# Altium project Underwater ROV PDB.PrjPcb
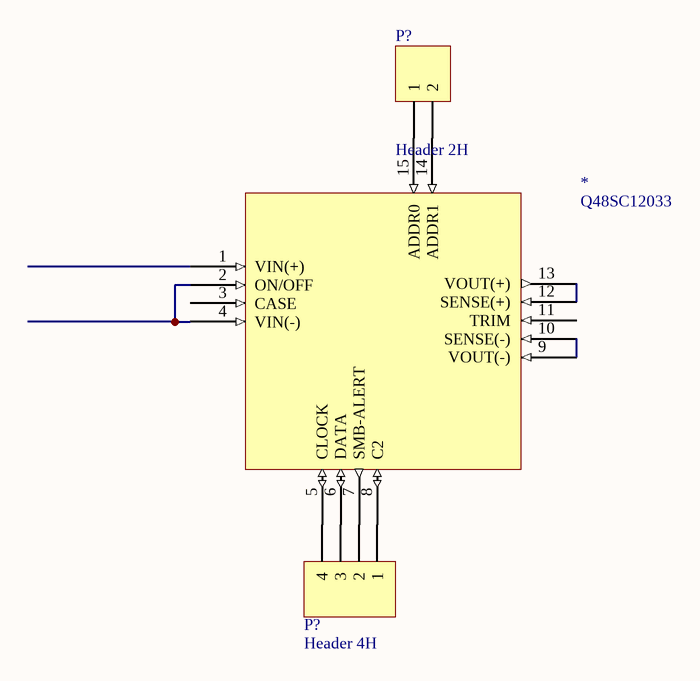
[diagram p0: Top_Level_Underwater_ROV_PDB.SchDoc]
2 sheets, 17 parts. Net scope: global (net labels, ports and power ports of the same name join across sheets).
Board file: 5V_Regulator.PcbDoc
Sheets:
  Top_Level_Underwater_ROV_PDB.SchDoc
  5V_Regulator.schdoc

## Sheet Top_Level_Underwater_ROV_PDB.SchDoc
size A

### Parts
(Parts that share a designator on the sheet are numbered #1, #2 ... from top to bottom, then left to right.)
*  Q48SC12033
P?#1  Header 2H  [HDR1X2H]
P?#2  Header 4H  [HDR1X4H]

### Nets
Net*_2: *.2(ON/OFF) *.4(VIN(-))
Net*_5: *.5(CLOCK) P?#2.4
Net*_6: *.6(DATA) P?#2.3
Net*_7: *.7(SMB-ALERT) P?#2.2
Net*_8: *.8(C2) P?#2.1
Net*_9: *.9(VOUT(-)) *.10(SENSE(-))
Net*_12: *.12(SENSE(+)) *.13(VOUT(+))
Net*_14: *.14(ADDR1) P?#1.2
Net*_15: *.15(ADDR0) P?#1.1

Not connected (* = marked no-connect by the designer): * 1(VIN(+)) 3(CASE) 11(TRIM)

### Library data of the parts
P?#1 = Header 2H: Header, 2-Pin, Right Angle; LatestRevisionDate: 17-Jul-2002; LatestRevisionNote: Re-released for DXP Platform.; Publisher: Altium Limited
P?#2 = Header 4H: Header, 4-Pin, Right Angle; LatestRevisionDate: 17-Jul-2002; LatestRevisionNote: Re-released for DXP Platform.; Publisher: Altium Limited

## Sheet 5V_Regulator.schdoc
size 394 x 144 mm; SheetNumber: 1; SheetTotal: 1
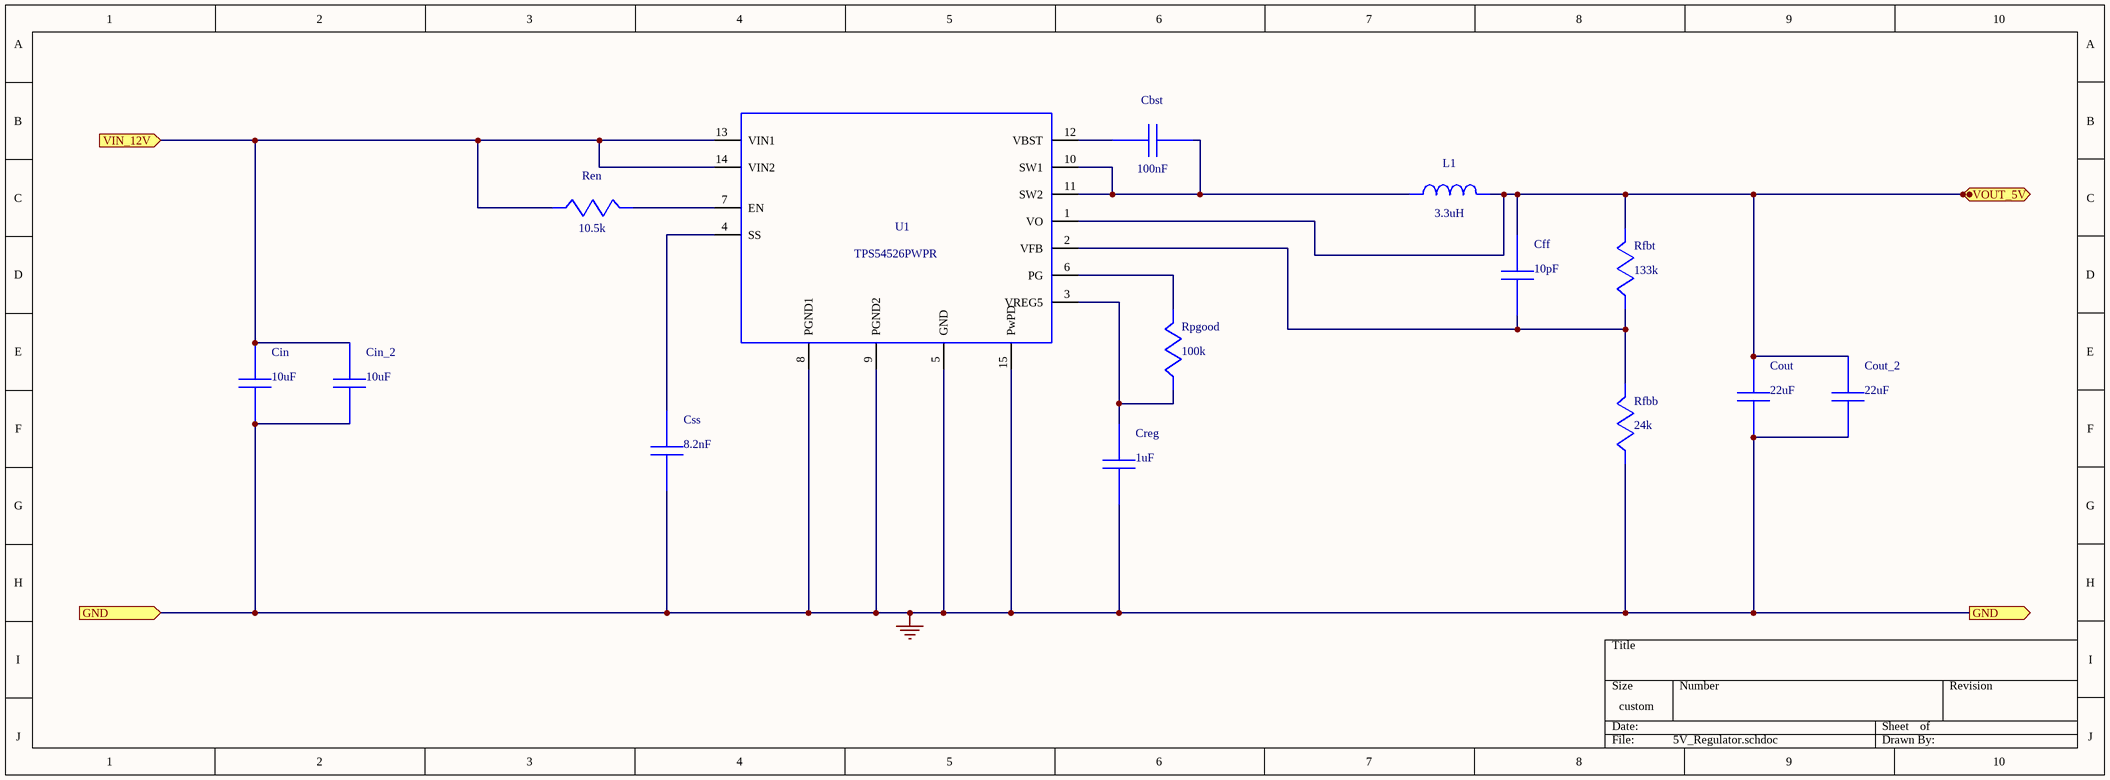
[diagram p1: 5V_Regulator.schdoc]

### Parts
Cbst  value 100nF  (hidden comment: GRM155R61A104KA01D)
Cff  value 10pF  (hidden comment: GCM0335C1E100JD03D)
Cin  value 10uF  (hidden comment: GRM21BR61C106KE15L)
Cin_2  value 10uF  (hidden comment: GRM21BR61C106KE15L)
Cout  value 22uF  (hidden comment: LMK212BJ226MG-T)
Cout_2  value 22uF  (hidden comment: LMK212BJ226MG-T)
Creg  value 1uF  (hidden comment: C0603C105Z8VACTU)
Css  value 8.2nF  (hidden comment: GRM033R61A822KA01D)
L1  value 3.3uH  (hidden comment: XAL5030-332MEB)
Ren  value 10.5k  (hidden comment: CRCW040210K5FKED)
Rfbb  value 24k  (hidden comment: RC0603FR-0724KL)
Rfbt  value 133k  (hidden comment: ERJ-6ENF1333V)
Rpgood  value 100k  (hidden comment: CRCW0402100KFKED)
U1  TPS54526PWPR

### Ports
GND (in), GND (out), VIN_12V (in), VOUT_5V (out)

### Nets
0: Cin.2 Cin_2.2 Cout.2 Cout_2.2 Creg.2 Css.2 Rfbb.2 U1.5(GND) U1.8(PGND1) U1.9(PGND2) U1.15(PwPD) ; port GND
NetCbst_1: Cbst.1 U1.12(VBST)
NetCbst_2: Cbst.2 L1.1 U1.10(SW1) U1.11(SW2)
NetCff_1: Cff.1 Cout.1 Cout_2.1 L1.2 Rfbt.1 U1.1(VO) ; port VOUT_5V
NetCff_2: Cff.2 Rfbb.1 Rfbt.2 U1.2(VFB)
NetCin_1: Cin.1 Cin_2.1 Ren.2 U1.13(VIN1) U1.14(VIN2) ; port VIN_12V
NetCreg_1: Creg.1 Rpgood.2 U1.3(VREG5)
NetCss_1: Css.1 U1.4(SS)
NetRen_1: Ren.1 U1.7(EN)
NetRpgood_1: Rpgood.1 U1.6(PG)

### Library data of the parts
Cbst = GRM155R61A104KA01D: GRM155R61A104KA0; Manufacturer Name: MuRata; PackageReference: GRM155R61A104KA01D; Manufacturer Part Number: GRM155R61A104KA01D
Cff = GCM0335C1E100JD03D: GCM0335C1E100JD0; Manufacturer Name: MuRata; PackageReference: GCM0335C1E100JD03D; Manufacturer Part Number: GCM0335C1E100JD03D
Cin Cin_2 = GRM21BR61C106KE15L: GRM21BR61C106KE1; Manufacturer Name: MuRata; PackageReference: GRM21BR61C106KE15L; Manufacturer Part Number: GRM21BR61C106KE15L
Cout Cout_2 = LMK212BJ226MG-T: Manufacturer Name: Taiyo Yuden; PackageReference: LMK212BJ226MG-T; Manufacturer Part Number: LMK212BJ226MG-T
Creg = C0603C105Z8VACTU: Manufacturer Name: Kemet; PackageReference: C0603C105Z8VACTU; Manufacturer Part Number: C0603C105Z8VACTU
Css = GRM033R61A822KA01D: GRM033R61A822KA0; Manufacturer Name: MuRata; PackageReference: GRM033R61A822KA01D; Manufacturer Part Number: GRM033R61A822KA01D
L1 = XAL5030-332MEB: Manufacturer Name: Coilcraft; PackageReference: XAL5030-332MEB; Manufacturer Part Number: XAL5030-332MEB
Ren = CRCW040210K5FKED: Manufacturer Name: Vishay-Dale; PackageReference: CRCW040210K5FKED; Manufacturer Part Number: CRCW040210K5FKED
Rfbb = RC0603FR-0724KL: Manufacturer Name: Yageo America; PackageReference: RC0603FR-0724KL; Manufacturer Part Number: RC0603FR-0724KL
Rfbt = ERJ-6ENF1333V: Manufacturer Name: Panasonic; PackageReference: ERJ-6ENF1333V; Manufacturer Part Number: ERJ-6ENF1333V
Rpgood = CRCW0402100KFKED: Manufacturer Name: Vishay-Dale; PackageReference: CRCW0402100KFKED; Manufacturer Part Number: CRCW0402100KFKED
U1 = TPS54526PWPR: Manufacturer Name: Texas Instruments; PackageReference: TPS54526PWPR; Manufacturer Part Number: TPS54526PWPR; Value: N/A